# Altium schematic sheet Capacitors.SchDoc
size A; SheetNumber: 2; SheetTotal: 2
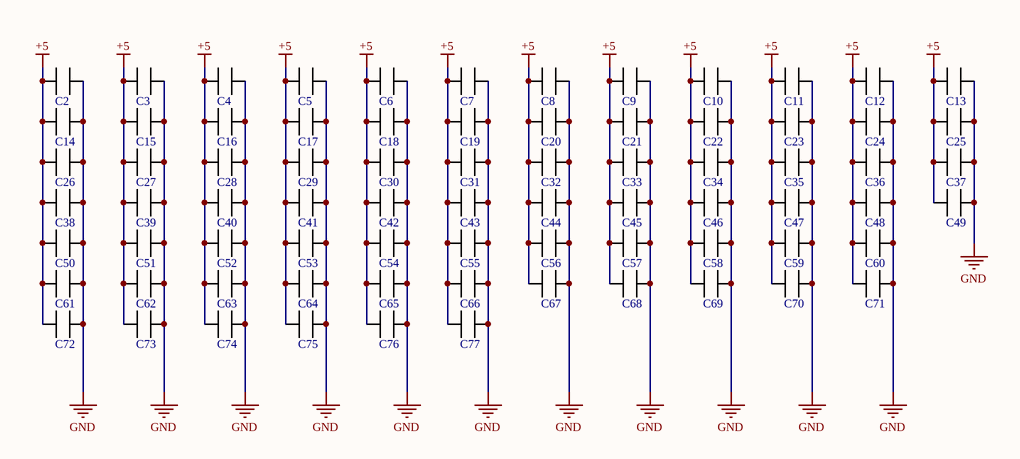
[diagram p0: Capacitors.SchDoc]

## Parts
C2  100nF  [CAP_0402]  (value not drawn)
C3  100nF  [CAP_0402]  (value not drawn)
C4  100nF  [CAP_0402]  (value not drawn)
C5  100nF  [CAP_0402]  (value not drawn)
C6  100nF  [CAP_0402]  (value not drawn)
C7  100nF  [CAP_0402]  (value not drawn)
C8  100nF  [CAP_0402]  (value not drawn)
C9  100nF  [CAP_0402]  (value not drawn)
C10  100nF  [CAP_0402]  (value not drawn)
C11  100nF  [CAP_0402]  (value not drawn)
C12  100nF  [CAP_0402]  (value not drawn)
C13  100nF  [CAP_0402]  (value not drawn)
C14  100nF  [CAP_0402]  (value not drawn)
C15  100nF  [CAP_0402]  (value not drawn)
C16  100nF  [CAP_0402]  (value not drawn)
C17  100nF  [CAP_0402]  (value not drawn)
C18  100nF  [CAP_0402]  (value not drawn)
C19  100nF  [CAP_0402]  (value not drawn)
C20  100nF  [CAP_0402]  (value not drawn)
C21  100nF  [CAP_0402]  (value not drawn)
C22  100nF  [CAP_0402]  (value not drawn)
C23  100nF  [CAP_0402]  (value not drawn)
C24  100nF  [CAP_0402]  (value not drawn)
C25  100nF  [CAP_0402]  (value not drawn)
C26  100nF  [CAP_0402]  (value not drawn)
C27  100nF  [CAP_0402]  (value not drawn)
C28  100nF  [CAP_0402]  (value not drawn)
C29  100nF  [CAP_0402]  (value not drawn)
C30  100nF  [CAP_0402]  (value not drawn)
C31  100nF  [CAP_0402]  (value not drawn)
C32  100nF  [CAP_0402]  (value not drawn)
C33  100nF  [CAP_0402]  (value not drawn)
C34  100nF  [CAP_0402]  (value not drawn)
C35  100nF  [CAP_0402]  (value not drawn)
C36  100nF  [CAP_0402]  (value not drawn)
C37  100nF  [CAP_0402]  (value not drawn)
C38  100nF  [CAP_0402]  (value not drawn)
C39  100nF  [CAP_0402]  (value not drawn)
C40  100nF  [CAP_0402]  (value not drawn)
C41  100nF  [CAP_0402]  (value not drawn)
C42  100nF  [CAP_0402]  (value not drawn)
C43  100nF  [CAP_0402]  (value not drawn)
C44  100nF  [CAP_0402]  (value not drawn)
C45  100nF  [CAP_0402]  (value not drawn)
C46  100nF  [CAP_0402]  (value not drawn)
C47  100nF  [CAP_0402]  (value not drawn)
C48  100nF  [CAP_0402]  (value not drawn)
C49  100nF  [CAP_0402]  (value not drawn)
C50  100nF  [CAP_0402]  (value not drawn)
C51  100nF  [CAP_0402]  (value not drawn)
C52  100nF  [CAP_0402]  (value not drawn)
C53  100nF  [CAP_0402]  (value not drawn)
C54  100nF  [CAP_0402]  (value not drawn)
C55  100nF  [CAP_0402]  (value not drawn)
C56  100nF  [CAP_0402]  (value not drawn)
C57  100nF  [CAP_0402]  (value not drawn)
C58  100nF  [CAP_0402]  (value not drawn)
C59  100nF  [CAP_0402]  (value not drawn)
C60  100nF  [CAP_0402]  (value not drawn)
C61  100nF  [CAP_0402]  (value not drawn)
C62  100nF  [CAP_0402]  (value not drawn)
C63  100nF  [CAP_0402]  (value not drawn)
C64  100nF  [CAP_0402]  (value not drawn)
C65  100nF  [CAP_0402]  (value not drawn)
C66  100nF  [CAP_0402]  (value not drawn)
C67  100nF  [CAP_0402]  (value not drawn)
C68  100nF  [CAP_0402]  (value not drawn)
C69  100nF  [CAP_0402]  (value not drawn)
C70  100nF  [CAP_0402]  (value not drawn)
C71  100nF  [CAP_0402]  (value not drawn)
C72  100nF  [CAP_0402]  (value not drawn)
C73  100nF  [CAP_0402]  (value not drawn)
C74  100nF  [CAP_0402]  (value not drawn)
C75  100nF  [CAP_0402]  (value not drawn)
C76  100nF  [CAP_0402]  (value not drawn)
C77  100nF  [CAP_0402]  (value not drawn)

## Nets
+5: C2.1 C3.1 C4.1 C5.1 C6.1 C7.1 C8.1 C9.1 C10.1 C11.1 C12.1 C13.1 C14.1 C15.1 C16.1 C17.1 C18.1 C19.1 C20.1 C21.1 C22.1 C23.1 C24.1 C25.1 C26.1 C27.1 C28.1 C29.1 C30.1 C31.1 C32.1 C33.1 C34.1 C35.1 C36.1 C37.1 C38.1 C39.1 C40.1 C41.1 C42.1 C43.1 C44.1 C45.1 C46.1 C47.1 C48.1 C49.1 C50.1 C51.1 C52.1 C53.1 C54.1 C55.1 C56.1 C57.1 C58.1 C59.1 C60.1 C61.1 C62.1 C63.1 C64.1 C65.1 C66.1 C67.1 C68.1 C69.1 C70.1 C71.1 C72.1 C73.1 C74.1 C75.1 C76.1 C77.1
GND: C2.2 C3.2 C4.2 C5.2 C6.2 C7.2 C8.2 C9.2 C10.2 C11.2 C12.2 C13.2 C14.2 C15.2 C16.2 C17.2 C18.2 C19.2 C20.2 C21.2 C22.2 C23.2 C24.2 C25.2 C26.2 C27.2 C28.2 C29.2 C30.2 C31.2 C32.2 C33.2 C34.2 C35.2 C36.2 C37.2 C38.2 C39.2 C40.2 C41.2 C42.2 C43.2 C44.2 C45.2 C46.2 C47.2 C48.2 C49.2 C50.2 C51.2 C52.2 C53.2 C54.2 C55.2 C56.2 C57.2 C58.2 C59.2 C60.2 C61.2 C62.2 C63.2 C64.2 C65.2 C66.2 C67.2 C68.2 C69.2 C70.2 C71.2 C72.2 C73.2 C74.2 C75.2 C76.2 C77.2

## Library data of the parts
C2-C77 = CAP_0402: note: any manufacturer; val: 100nF